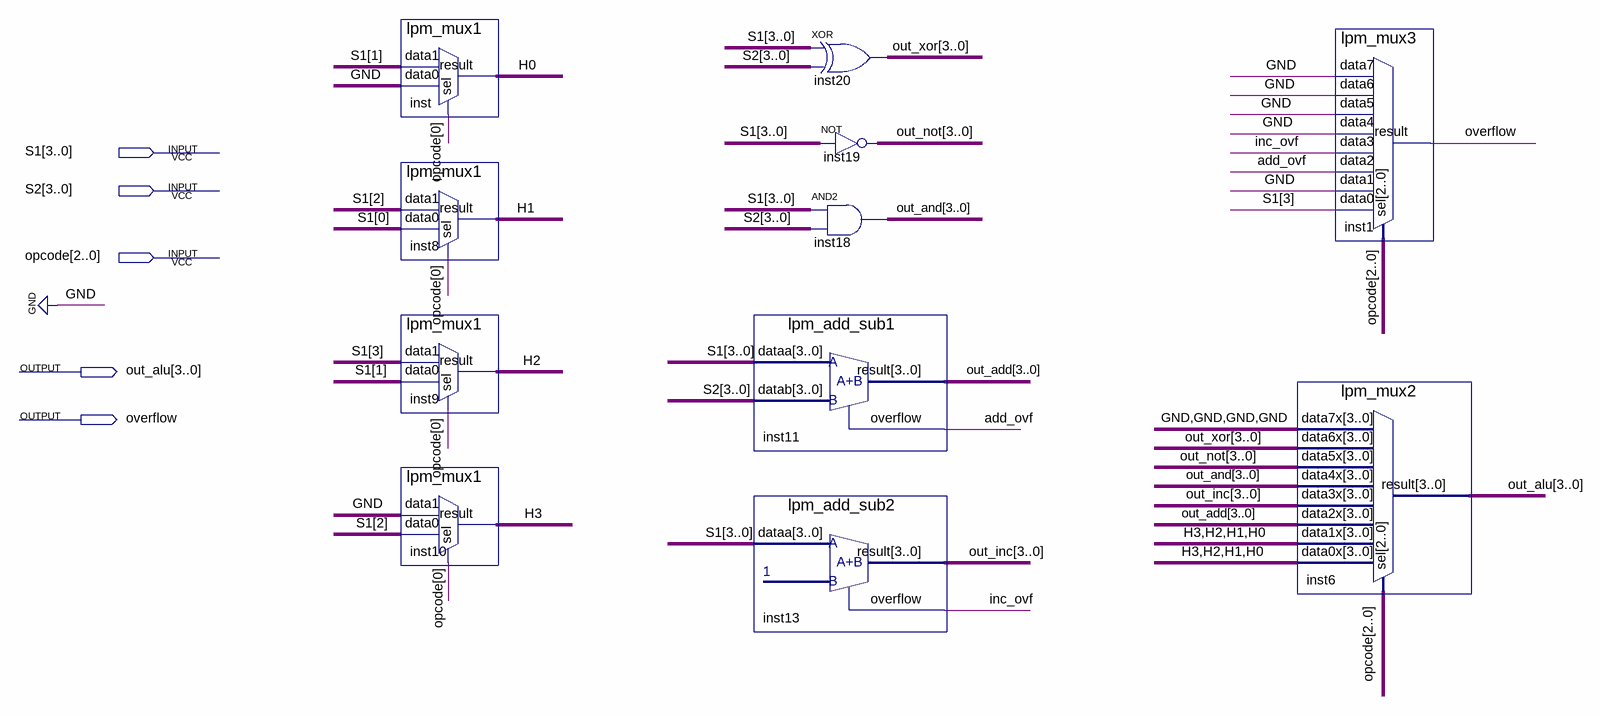
[diagram p0: schematic sheet]
// Quartus schematic ALU.bdf as structural Verilog: 11 symbols, 5 pins
module ALU (
  input  [3:0] S1,
  input  [3:0] S2,
  input  [2:0] opcode,
  output [3:0] out_alu,
  output overflow
);

  wire add_ovf, H0, H1, H2, H3, inc_ovf;
  wire [3:0] out_add, out_and, out_inc, out_not, out_xor;

  lpm_mux1 inst (.data1(S1[1]), .data0(1'b0), .sel(opcode[0]), .result(H0));
  lpm_mux1 inst8 (.data1(S1[2]), .data0(S1[0]), .sel(opcode[0]), .result(H1));
  lpm_mux1 inst9 (.data1(S1[3]), .data0(S1[1]), .sel(opcode[0]), .result(H2));
  lpm_mux1 inst10 (.data1(1'b0), .data0(S1[2]), .sel(opcode[0]), .result(H3));
  assign out_xor = S1 ^ S2;  // XOR inst20, 4 bits wide
  assign out_not = ~S1;  // NOT inst19, 4 bits wide
  assign out_and = S1 & S2;  // AND2 inst18, 4 bits wide
  lpm_add_sub1 inst11 (.dataa(S1), .datab(S2), .result(out_add), .overflow(add_ovf));
  lpm_add_sub2 inst13 (.dataa(S1), .result(out_inc), .overflow(inc_ovf));
  lpm_mux3 inst1 (
    .data7(1'b0), .data6(1'b0), .data5(1'b0), .data4(1'b0), .data3(inc_ovf), .data2(add_ovf), .data1(1'b0),
    .data0(S1[3]), .sel(opcode), .result(overflow));
  lpm_mux2 inst6 (
    .data7x(4'b0000), .data6x(out_xor), .data5x(out_not), .data4x(out_and), .data3x(out_inc),
    .data2x(out_add), .data1x({H3, H2, H1, H0}), .data0x({H3, H2, H1, H0}), .sel(opcode), .result(out_alu));
endmodule
